# EAGLE design fortuna_v21_othermill (EAGLE 8.1.0)
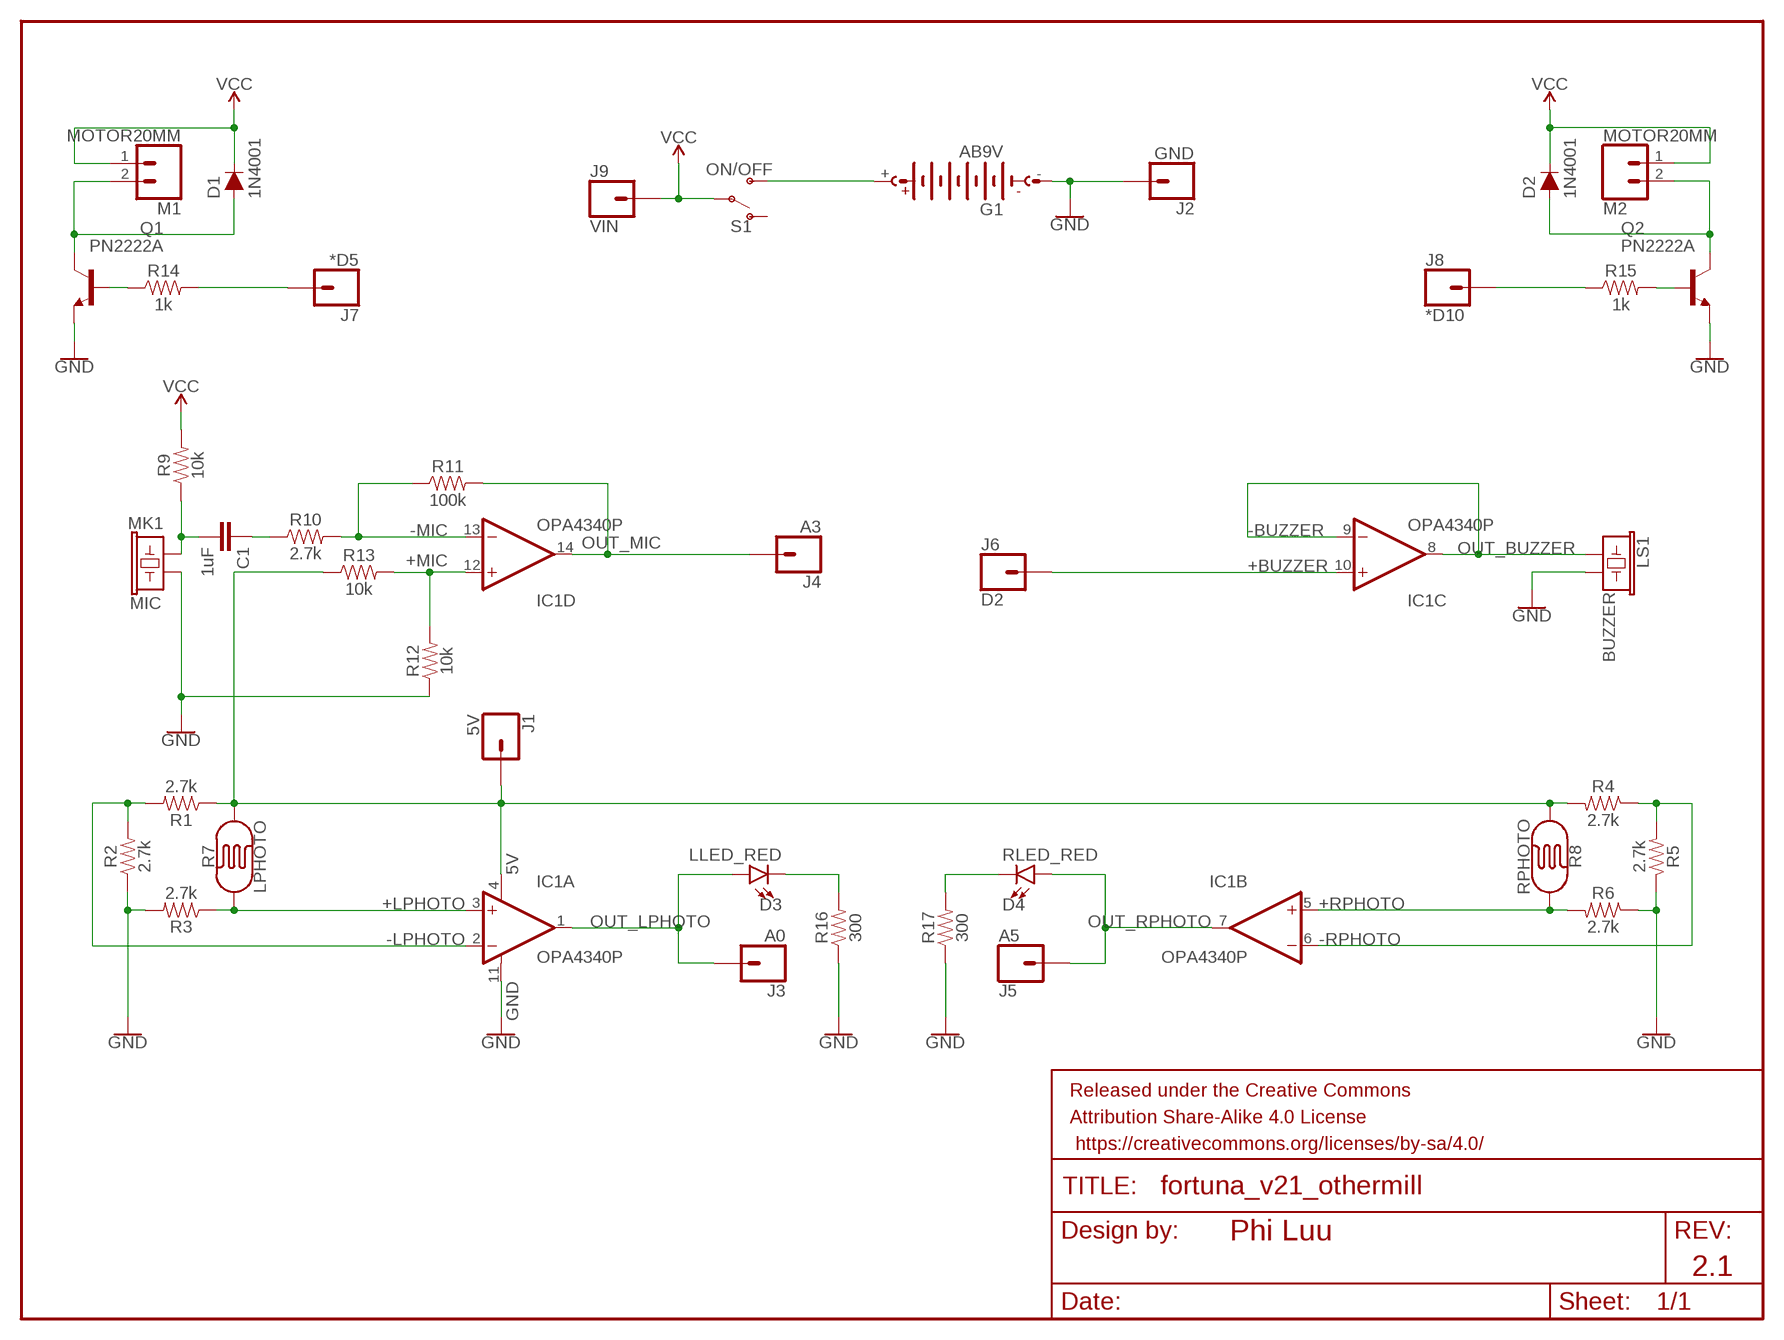
[diagram p0: schematic, sheet 1]

## Parts
C1  1uF  0.1UF-KIT-EZ-50V-20%  [CAP-PTH-SMALL-KIT]
D1  1N4001  DIODE-PTH  [DIODE-1N4001]
D2  1N4001  DIODE-PTH  [DIODE-1N4001]
D3  LLED_RED  LED5MM  [LED_5MM]
D4  RLED_RED  LED5MM  [LED_5MM]
FRAME1  FRAME-LETTER  [CREATIVE_COMMONS]
G1  AB9V  [AB9V]
IC1  OPA4340P  [DIL14]
J1  5V  CONN_01  [1X01]
J2  GND  CONN_01  [1X01]
J3  A0  CONN_01  [1X01]
J4  A3  CONN_01  [1X01]
J5  A5  CONN_01  [1X01]
J6  D2  CONN_01  [1X01]
J7  *D5  CONN_01  [1X01]
J8  *D10  CONN_01  [1X01]
J9  VIN  CONN_01  [1X01]
LS1  BUZZER  BUZZER-PTH  [BUZZER-12MM]
M1  MOTOR20MM  CONN_02  [1X02]
M2  MOTOR20MM  CONN_02  [1X02]
MK1  MIC  MIC-PTH  [MICROPHONE-PTH-9.7MM]
Q1  PN2222A  2N2222  [TO92-EBC-OVAL]
Q2  PN2222A  2N2222  [TO92-EBC-OVAL]
R1  2.7k  1KOHM-HORIZ-1/4W-5%  [AXIAL-0.3]
R2  2.7k  1KOHM-HORIZ-1/4W-5%  [AXIAL-0.3]
R3  2.7k  1KOHM-HORIZ-1/4W-5%  [AXIAL-0.3]
R4  2.7k  1KOHM-HORIZ-1/4W-5%  [AXIAL-0.3]
R5  2.7k  1KOHM-HORIZ-1/4W-5%  [AXIAL-0.3]
R6  2.7k  1KOHM-HORIZ-1/4W-5%  [AXIAL-0.3]
R7  LPHOTO  PHOTOCELLPTH  [PHOTOCELL]
R8  RPHOTO  PHOTOCELLPTH  [PHOTOCELL]
R9  10k  1KOHM-HORIZ-1/4W-5%  [AXIAL-0.3]
R10  2.7k  1KOHM-HORIZ-1/4W-5%  [AXIAL-0.3]
R11  100k  1KOHM-HORIZ-1/4W-5%  [AXIAL-0.3]
R12  10k  1KOHM-HORIZ-1/4W-5%  [AXIAL-0.3]
R13  10k  1KOHM-HORIZ-1/4W-5%  [AXIAL-0.3]
R14  1k  1KOHM-HORIZ-1/4W-5%  [AXIAL-0.3]
R15  1k  1KOHM-HORIZ-1/4W-5%  [AXIAL-0.3]
R16  300  1KOHM-HORIZ-1/4W-5%  [AXIAL-0.3]
R17  300  1KOHM-HORIZ-1/4W-5%  [AXIAL-0.3]
S1  ON/OFF  SWITCH-SPDT-PTH-11.6X4.0MM  [SWITCH_SPDT_PTH_11.6X4.0MM]

## Nets
5V: IC1.4(A:V+) J1.1 R1.P$1 R4.P$2 R7.2 R8.2 R13.P$1
9V: G1.+ S1.3(S)
+BUZZER: IC1.10(C:+IN) J6.1
+LPHOTO: IC1.3(A:+IN) R3.P$1 R7.1
+MIC: IC1.12(D:+IN) R12.P$2 R13.P$2
+RPHOTO: IC1.5(B:+IN) R6.P$2 R8.1
-LPHOTO: IC1.2(A:-IN) R1.P$2 R2.P$2
-MIC: IC1.13(D:-IN) R10.P$2 R11.P$1
-RPHOTO: IC1.6(B:-IN) R4.P$1 R5.P$2
GND: G1.- IC1.11(A:V-) J2.1 LS1.- MK1.GND Q1.E Q2.E R2.P$1 R3.P$2 R5.P$1 R6.P$1 R12.P$1 R16.P$1 R17.P$1
N$1: C1.2 MK1.OUT R9.P$1
N$2: C1.1 R10.P$1
N$3: D3.K(C) R16.P$2
N$4: D4.K(C) R17.P$2
N$9: Q1.B R14.P$1
N$10: D1.A M1.2 Q1.C
N$12: D2.A M2.2 Q2.C
N$14: Q2.B R15.P$2
OUT_BUZZER: IC1.8(C:OUT) IC1.9(C:-IN) LS1.+
OUT_LMOTOR: J7.1 R14.P$2
OUT_LPHOTO: D3.A IC1.1(A:OUT) J3.1
OUT_MIC: IC1.14(D:OUT) J4.1 R11.P$2
OUT_RMOTOR: J8.1 R15.P$1
OUT_RPHOTO: D4.A IC1.7(B:OUT) J5.1
VCC: D1.C D2.C J9.1 M1.1 M2.1 R9.P$2 S1.2(P)
Unconnected: S1.1(O)

## Notes on the sheet
- -BUZZER
- +BUZZER
- Phi Luu
- 2.1

## Library data of the parts
C1 = SparkFun-Capacitors:0.1UF: 0.1µF ceramic capacitors A capacitor is a passive two-terminal electrical component used to store electrical energy temporarily in an electric field.; PROD_ID: CAP-08370; VALUE: 0.1uF
D1 D2 = SparkFun-DiscreteSemi:DIODE: Diode These are standard reverse protection diodes and small signal diodes. SparkFun Products: SparkFun SparkPunk Sound Kit <https://www.sparkfun.com/products/11177> SparkFun ESP8266 Thing <https://www.sparkfun.com/products/13231>; PROD_ID: DIO-09176; VALUE: 1A/50V/1.1V
D3 D4 = SparkFun-LED:LED: LED (Generic) Standard schematic elements and footprints for 5mm, 3mm, 1206, and 0603 sized LEDs. Generic LEDs with no color specified.
FRAME1 = SparkFun-Aesthetics:FRAME-LETTER: Schematic Frame - Letter Standard 8.5x11 US Letter frame
G1 = battery:AB9V: 9-V BATTERY CLIP
IC1 = burr-brown:OPA4340: Operational Amplifiers Source: http://focus.ti.com/lit/ds/sbos073/sbos073.pdf; OC_FARNELL: unknown; OC_NEWARK: unknown
J1-J9 = SparkFun-Connectors:CONN_01: Single connection point. Often used as Generic Header-pin footprint for 0.1 inch spaced/style header connections On any of the 0.1 inch spaced packages, you can populate with these: Break Away Headers - Straight <https://www.sparkfun.com/products/116> (PRT-00116) Break Away Male Headers - Right Angle <https://www.sparkfun.com/products/553> (PRT-00553) Female Headers <https://www.sparkfun.com/products/115> (PRT-00115) Break Away Headers - Machine Pin <https://www.sparkfun.com/products/117> (PRT-00117) Break Away Female Headers - Swiss Machine Pin <https://www.sparkfun.com/products/743> (PRT-00743) This device is also useful as a general connection point to wire up your design to another part of your project. Our various solder wires solder well into these plated through hole pads. Hook-Up Wire - Assortment (Stranded, 22 AWG) <https://www.sparkfun.com/products/11375> (PRT-11375) Hook-Up Wire - Assortment (Solid Core, 22 AWG) <https://www.sparkfun.com/products/11367> (PRT-11367) View the entire wire category on our website here <https://www.sparkfun.com/categories/141> Special notes: SMTSO-256-ET is a "flush mount" nut for a 4-40 screw. We mostly use this on specialty testbeds; it is a nice way to connect hardware to your PCB at an adjustable hieght. Also note, the SNAP packages are for using a snappable style connector. We sell a baggie of snaps and they are also used on two LilyPad designs: Snap Assortment - 30 pack (male and female) <https://www.sparkfun.com/products/11347> (DEV-11347) LilyPad Arduino SimpleSnap <https://www.sparkfun.com/products/10941> (DEV-10941) LilyPad SimpleSnap Protoboard <https://www.sparkfun.com/products/10940> (DEV-10940)
LS1 = SparkFun-Electromechanical:BUZZER: Buzzer Small round buzzers that operate around the audible 2kHz range. You can use these as speakers to create simple music or user interfaces. Variant Overview: PTH - Mini Speaker - PC Mount 12mm 2.048kHz <https://www.sparkfun.com/products/7950> PTH_KIT - Mini Speaker - PC Mount 12mm 2.048kHz <https://www.sparkfun.com/products/7950> KIT simplifies soldering by adding stop mask to one side of the pads. PTH_NO_SILK - Mini Speaker - PC Mount 12mm 2.048kHz <https://www.sparkfun.com/products/7950> No silkscreen indicator of buzzer outline. PTH_KIT_NO_SILK - Mini Speaker - PC Mount 12mm 2.048kHz <https://www.sparkfun.com/products/7950> KIT package w/o silkscreen SMD - Buzzer Audio Magnetic (CCV-084B16) SMD buzzer used on, e.g. the LilyPad Buzzer <https://www.sparkfun.com/products/8463> and RFID USB Reader <https://www.sparkfun.com/products/9963>. SMD_KIT - Buzzer Audio Magnetic (CCV-084B16) SMD Buzzer with elongated pins to make soldering easier. Used on the SparkFun Simon Says - Surface Mount Soldering Kit <https://www.sparkfun.com/products/10935>.; PROD_ID: COMP-08253; SF_SKU: COM-07950
M1 M2 = SparkFun-Connectors:CONN_02: Multi connection point. Often used as Generic Header-pin footprint for 0.1 inch spaced/style header connections On any of the 0.1 inch spaced packages, you can populate with these: Break Away Headers - Straight <https://www.sparkfun.com/products/116> (PRT-00116) Break Away Male Headers - Right Angle <https://www.sparkfun.com/products/553> (PRT-00553) Female Headers <https://www.sparkfun.com/products/115> (PRT-00115) Break Away Headers - Machine Pin <https://www.sparkfun.com/products/117> (PRT-00117) Break Away Female Headers - Swiss Machine Pin <https://www.sparkfun.com/products/743> (PRT-00743) For SCREWTERMINALS and SPRING TERMINALS visit here: Screw Terimnals on SparkFun.com <https://www.sparkfun.com/search/results?term=Screw+Terminals> (5mm/3.5mm/2.54mm spacing) This device is also useful as a general connection point to wire up your design to another part of your project. Our various solder wires solder well into these plated through hole pads. Hook-Up Wire - Assortment (Stranded, 22 AWG) <https://www.sparkfun.com/products/11375> (PRT-11375) Hook-Up Wire - Assortment (Solid Core, 22 AWG) <https://www.sparkfun.com/products/11367> (PRT-11367) View the entire wire category on our website here <https://www.sparkfun.com/categories/141> Special notes: Molex polarized connector foot print use with: PRT-08233 with associated crimp pins and housings. 2.54_SCREWTERM for use with PRT-10571. 3.5mm Screw Terminal footprints for PRT-08084 5mm Screw Terminal footprints for use with PRT-08432
MK1 = SparkFun-Sensors:MIC: Microphone Omni-directional electret microphones - one through-hole, the other SMD. Datasheet <http://cdn.sparkfun.com/datasheets/Sensors/Sound/CEM-C9745JAD462P2.54R.pdf> (through-hole mic) Datasheet <http://www.challengeelectronics.com/downloads/microphones/omni_directional/CEM-OB6018-3EAD443C43MR.pdf> (SMD mic) SparkFun Products PTH Electret Microphone <https://www.sparkfun.com/products/8635> (COM-08635) SparkFun Electret Microphone Breakout <https://www.sparkfun.com/products/9964> (BOB-09964) Digital Sandbox <https://www.sparkfun.com/products/12651> (DEV-12651) SparkFun Sound Detector <https://www.sparkfun.com/products/12642> (SEN-12642) SMD Microphone SparkFun Voice Recorder Breakout - ISD1932 <https://www.sparkfun.com/products/retired/10653> (BOB-10653); PROD_ID: COMP-08856; SF_ID: COM-08635
Q1 Q2 = Adafruit:2N2222: NPN TRANSISTOR Big oval pads
R1-R6 R9-R13 R16 R17 = SparkFun-Resistors:1KOHM: 1kΩ resistor A resistor is a passive two-terminal electrical component that implements electrical resistance as a circuit element. Resistors act to reduce current flow, and, at the same time, act to lower voltage levels within circuits. - Wikipedia; PROD_ID: RES-08380; VALUE: 1k
R7 R8 = SparkFun-Sensors:PHOTOCELL: Photocell (Photodetector, Photo Resistor, CdS) This is a very small light sensor. A photocell changes (also called a photodetector, photo resistor, CdS or photoconductive cell) resistance depending on the amount of light it is exposed to. These little sensors make great ambient light triggers (when light in the room turns on, do something). Datasheet <http://cdn.sparkfun.com/datasheets/Sensors/LightImaging/SEN-09088.pdf> SparkFun Products Mini Photocell <https://www.sparkfun.com/products/9088> (SEN-09088); PROD_ID: COMP-09129; SF_ID: SEN-09088
R14 R15 = SparkFun-Resistors:1KOHM: 1kΩ resistor A resistor is a passive two-terminal electrical component that implements electrical resistance as a circuit element. Resistors act to reduce current flow, and, at the same time, act to lower voltage levels within circuits. - Wikipedia; PROD_ID: RES-08380
S1 = SparkFun-Switches:SWITCH-SPDT: Single Pole, Double Throw (SPDT) Switch Single-pole, double-throw (SPDT) switch. Variant Overview SMD-AYZ0202 Surface Mount DPDT Switch <https://www.sparkfun.com/products/597> (COM-00597) Used on e.g. LilyPad Arduino USB - ATmega32U4 Board <https://www.sparkfun.com/products/12049> PTH-11.6X4.0MM SPDT Mini Power Switch <https://www.sparkfun.com/products/102> (COM-00102) Used on e.g. SparkFun Simon Says - Through-Hole Soldering Kit <https://www.sparkfun.com/products/10547> (KIT-10547) PTH-11.6X4.0MM-KIT KIT version of SPDT Mini Power Switch - Simplifies soldering by removing tStop of switch pins - only one side can be soldered. PTH-11.6X4.0MM-LOCK LOCK version of SPDT Mini Power Switch - Offset pins hold switch in place for easier soldering. SMD-RIGHT-ANGLE Surface Mount Right Angle Switch <https://www.sparkfun.com/products/10860> (COM-10860) Used on e.g. SparkFun ESP8266 Thing <https://www.sparkfun.com/products/13231>; PROD_ID: SWCH-08261; SF_SKU: COM-00102

## Net classes
0 default: width 0.406 mm

## Board
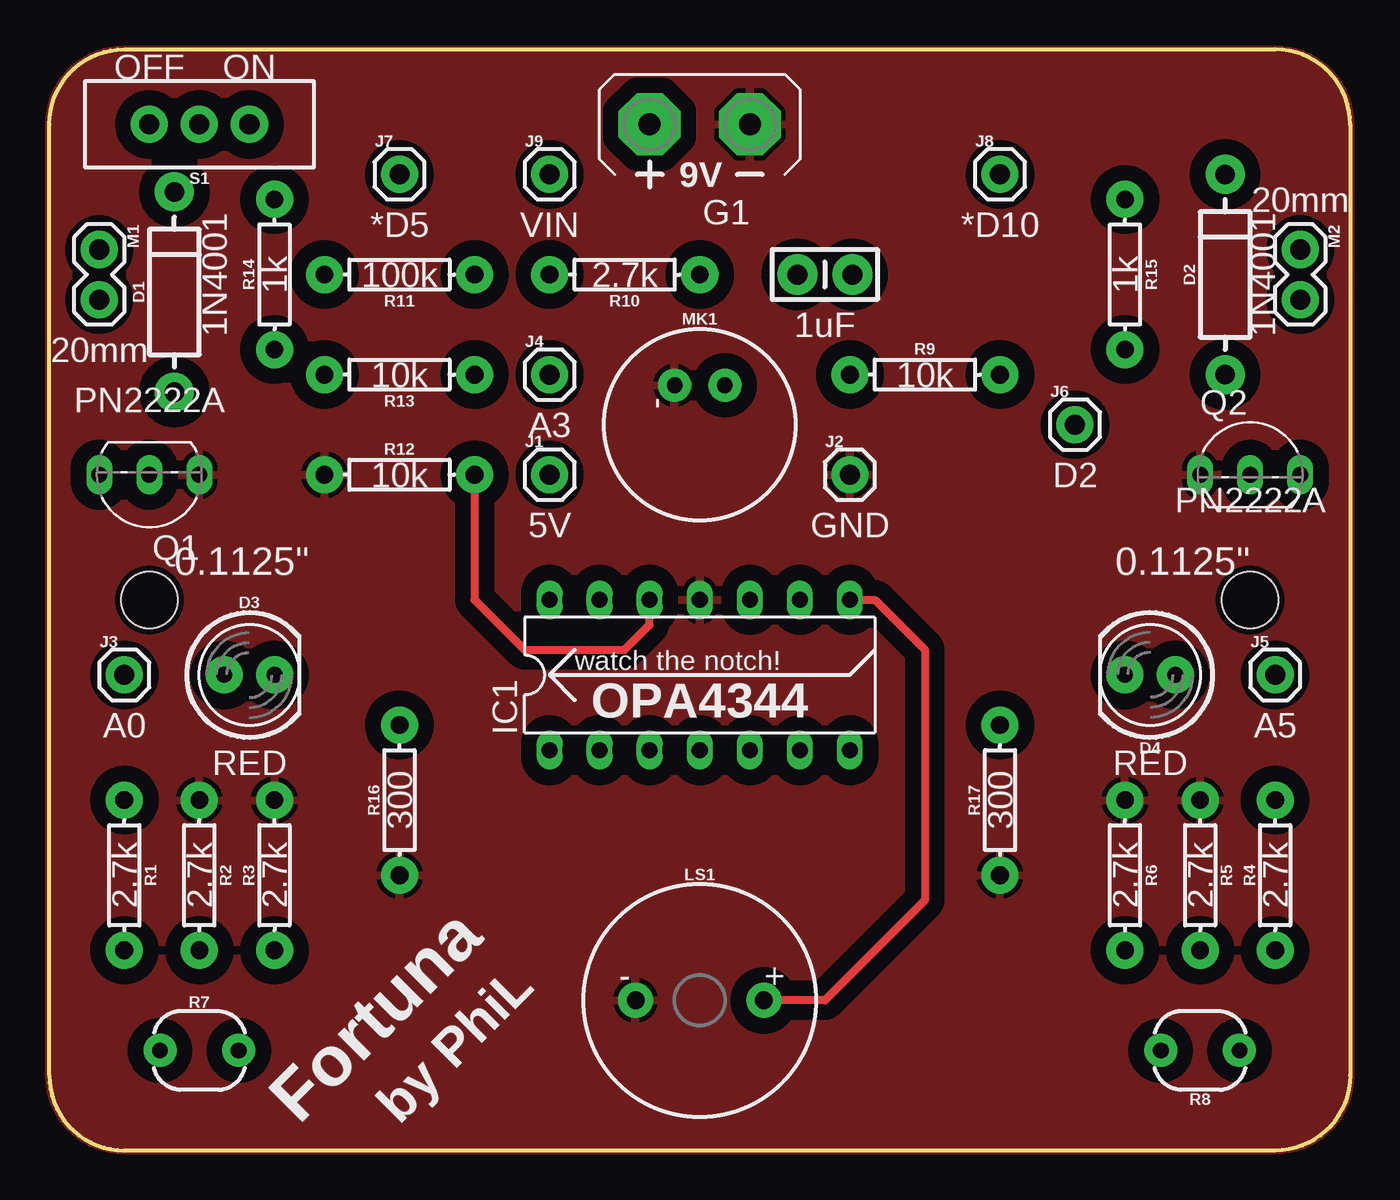
[diagram p1: board, top side]
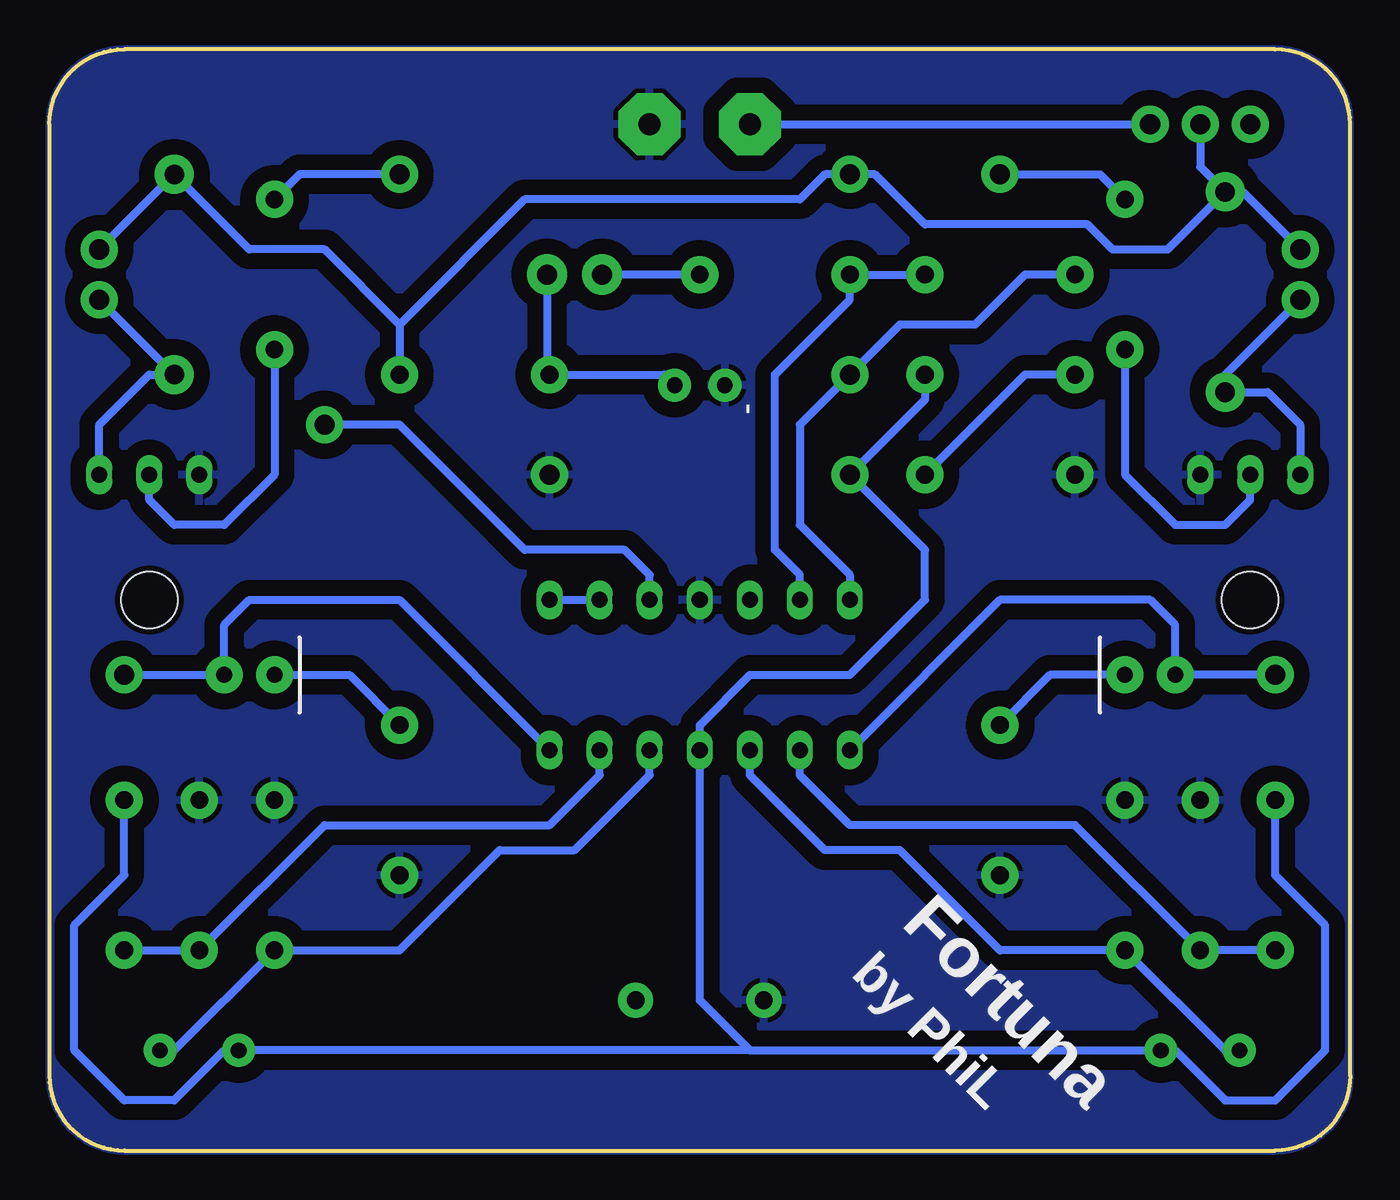
[diagram p2: board, bottom side, seen from below]

Size 66.04 x 55.88 mm. Coordinates in mm from the lower left corner, seen from the top.
Outline: 0,3.81 0,52.07 arc-90 3.81,55.88 62.23,55.88 arc-90 66.04,52.07 66.04,3.81 arc-90 62.23,0 3.81,0 arc-90 0,3.81
Copper layers (1*16): Top 0.035mm / dielectric 1.5mm / Bottom 0.035mm
Design rules "OthermillDRC_1_32_v2": minimum track width 8mil, minimum drill 0.8mm, track to track 0.794003125mm, track to pad 0.794003125mm, pad to pad 0.794003125mm, via to via 0.794003125mm, smd to smd 0mil, copper to edge 0mil, drill to drill 1mil, minimum pad ring 10mil, minimum via ring 10mil, stop-mask expansion 1mil, vias tented up to drill 30mil, thermal gap 10mil
Holes 2.86 mm at 5.08,27.94 60.96,27.94

### Footprints (pad centres in the part's own frame; a part is rotated, then mirrored left to right if it is on the bottom)
CAP-PTH-SMALL-KIT = drill 1.016 pad 2.032: 1 -1.397,0; 2 1.397,0
DIODE-1N4001 = drill 1 pad 1.981: A -5.08,0; C 5.08,0
LED_5MM = drill 0.813 pad 1.88: A -1.27,0; K 1.27,0
AB9V = drill 1.118 pad 3.15 octagon: + 0,2.54; - 0,-2.54
DIL14 = drill 0.813 long: 1 -7.62,-3.81; 2 -5.08,-3.81; 3 -2.54,-3.81; 4 0,-3.81; 5 2.54,-3.81; 6 5.08,-3.81; 7 7.62,-3.81; 8 7.62,3.81; 9 5.08,3.81; 10 2.54,3.81; 11 0,3.81; 12 -2.54,3.81; 13 -5.08,3.81; 14 -7.62,3.81
1X01 = drill 1.016 pad 1.88: 1 0,0
BUZZER-12MM = drill 0.9 pad 1.778: + 3.25,0; - -3.25,0
1X02 = drill 1.016 pad 1.88: 1 0,0; 2 2.54,0
MICROPHONE-PTH-9.7MM = drill 0.8 pad 1.676: GND -2,-1.27; OUT -2,1.27
TO92-EBC-OVAL = drill 0.813 long: B 0,-1.27; C 2.54,-1.27; E -2.54,-1.27
AXIAL-0.3 = drill 0.9 pad 1.88: P$1 -3.81,0; P$2 3.81,0
PHOTOCELL = drill 0.8 pad 1.676: 1 -2,0; 2 2,0
SWITCH_SPDT_PTH_11.6X4.0MM = drill 1.016 pad 1.88: 1 0,2.54; 2 0,0; 3 0,-2.54

### Placement (x,y rotation side)
C1  39.37,44.45 0 top
D1  6.35,43.56 90 top
D2  59.69,44.45 90 top
D3  10.16,24.13 0 top
D4  55.88,24.13 180 top
FRAME1  0,-7.62 0 top  (outside the outline)
G1  33.02,52.07 90 top
IC1  33.02,24.13 0 top
J1  25.4,34.29 0 top
J2  40.64,34.29 0 top
J3  3.81,24.13 0 top
J4  25.4,39.37 0 top
J5  62.23,24.13 0 top
J6  52.07,36.83 0 top
J7  17.78,49.53 0 top
J8  48.26,49.53 0 top
J9  25.4,49.53 0 top
LS1  33.02,7.62 0 top
M1  2.54,45.72 270 top
M2  63.5,45.72 270 top
MK1  33.02,36.83 270 top
Q1  5.08,33.02 180 top
Q2  60.96,35.56 0 top
R1  3.81,13.97 270 top
R2  7.62,13.97 270 top
R3  11.43,13.97 90 top
R4  62.23,13.97 90 top
R5  58.42,13.97 270 top
R6  54.61,13.97 270 top
R7  7.62,5.08 0 top
R8  58.42,5.08 180 top
R9  44.45,39.37 0 top
R10  29.21,44.45 180 top
R11  17.78,44.45 180 top
R12  17.78,34.29 0 top
R13  17.78,39.37 180 top
R14  11.43,44.45 90 top
R15  54.61,44.45 270 top
R16  17.78,17.78 90 top
R17  48.26,17.78 90 top
S1  7.62,52.07 90 top

### Tracks (layer width: path | path; a pad name or v marks a point on that pad's centre or on a via)
5V
  Bottom 0.406: R1.P$1 3.81,13.97 1.27,11.43 1.27,5.08 3.81,2.54 6.35,2.54 8.89,5.08 R7.2 30.48,5.08 | R4.P$2 62.23,13.97 64.77,11.43 64.77,5.08 62.23,2.54 59.69,2.54 57.15,5.08 R8.2 30.48,5.08 | 30.48,5.08 33.02,7.62 IC1.4 33.02,21.59 30.48,24.13 25.4,24.13 21.59,27.94 21.59,30.48 J1.1 21.59,38.1 R13.P$1
9V
  Bottom 0.406: G1.+ S1.3
+BUZZER
  Bottom 0.406: IC1.10 35.56,29.21 36.83,30.48 41.91,30.48 48.26,36.83 J6.1
+LPHOTO
  Bottom 0.406: R7.1 6.35,5.08 R3.P$1 17.78,10.16 22.86,15.24 26.67,15.24 30.48,19.05 IC1.3
+MIC
  Top 0.406: R12.P$2 21.59,27.94 24.13,25.4 29.21,25.4 30.48,26.67 IC1.12
  Bottom 0.406: R13.P$2 16.51,39.37 R12.P$2
+RPHOTO
  Bottom 0.406: IC1.5 35.56,19.05 39.37,15.24 43.18,15.24 48.26,10.16 R6.P$2 59.69,5.08 R8.1
-LPHOTO
  Bottom 0.406: R1.P$2 R2.P$2 13.97,16.51 25.4,16.51 27.94,19.05 IC1.2
-MIC
  Bottom 0.406: R11.P$1 R10.P$2 25.4,43.18 29.21,39.37 29.21,30.48 27.94,29.21 IC1.13
-RPHOTO
  Bottom 0.406: R4.P$1 R5.P$2 52.07,16.51 40.64,16.51 38.1,19.05 IC1.6
GND
  pour Bottom (isolate 0.305): 0,3.81 0,52.07 arc-90 3.81,55.88 62.23,55.88 arc-90 66.04,52.07 66.04,3.81 arc-90 62.23,0 3.81,0 arc-90
  pour Top (isolate 0.305): 0,3.81 0,52.07 arc-90 3.81,55.88 62.23,55.88 arc-90 66.04,52.07 66.04,3.81 arc-90 62.23,0 3.81,0 arc-90
N$1
  Bottom 0.406: C1.2 40.77,39.5 R9.P$1 34.83,39.37 MK1.OUT
N$2
  Bottom 0.406: R10.P$1 C1.1
N$3
  Bottom 0.406: D3.K 15.24,24.13 R16.P$2
N$4
  Bottom 0.406: D4.K 50.8,24.13 R17.P$2
N$9
  Bottom 0.406: R14.P$1 11.43,34.29 8.89,31.75 6.35,31.75 5.08,33.02 Q1.B
N$10
  Bottom 0.406: M1.2 6.35,39.37 D1.A 4.19,38.48 2.54,36.83 Q1.C
N$12
  Bottom 0.406: M2.2 D2.A 60.96,39.37 63.5,36.83 Q2.C
N$14
  Bottom 0.406: R15.P$2 54.61,34.29 57.15,31.75 59.69,31.75 60.96,33.02 Q2.B
OUT_BUZZER
  Top 0.406: IC1.8 41.91,27.94 44.45,25.4 44.45,12.7 39.37,7.62 LS1.+
  Bottom 0.406: IC1.8 IC1.9
OUT_LMOTOR
  Bottom 0.406: J7.1 12.7,49.53 R14.P$2
OUT_LPHOTO
  Bottom 0.406: J3.1 D3.A 8.89,26.67 10.16,27.94 17.78,27.94 IC1.1
OUT_MIC
  Bottom 0.406: R11.P$2 16.51,44.45 19.05,41.91 22.86,41.91 J4.1 27.94,36.83 27.94,31.75 25.4,29.21 IC1.14
OUT_RMOTOR
  Bottom 0.406: J8.1 53.34,49.53 R15.P$1
OUT_RPHOTO
  Bottom 0.406: J5.1 D4.A 57.15,26.67 55.88,27.94 48.26,27.94 IC1.7
VCC
  Bottom 0.406: 48.26,41.91 41.91,48.26 27.94,48.26 26.67,49.53 J9.1 24.13,49.53 21.59,46.99 13.34,46.99 12.06,45.72 9.27,45.72 D1.C | 48.26,41.91 R9.P$2 | 48.26,41.91 52.07,45.72 55.88,45.72 D2.C M2.1 | S1.2 7.62,49.91 D1.C | D1.C 5.46,48.64 M1.1

### Text on the board
tPlace: OFF | ON | 20mm | *D5 | VIN | *D10 | 1N4001 | 1k | 100k | 2.7k | 1k | 1N4001 | 1uF | 20mm | 10k | 10k | PN2222A | A3 | 10k | D2 | PN2222A | 5V | GND | 0.1125" | 0.1125" | watch the notch! | OPA4344 | A0 | A5 | RED | RED | 300 | 300 | 2.7k | 2.7k | 2.7k | 2.7k | 2.7k | 2.7k | - | + | Fortuna | by PhiL
bPlace: Fortuna | by PhiL
tDocu: Phi Luu